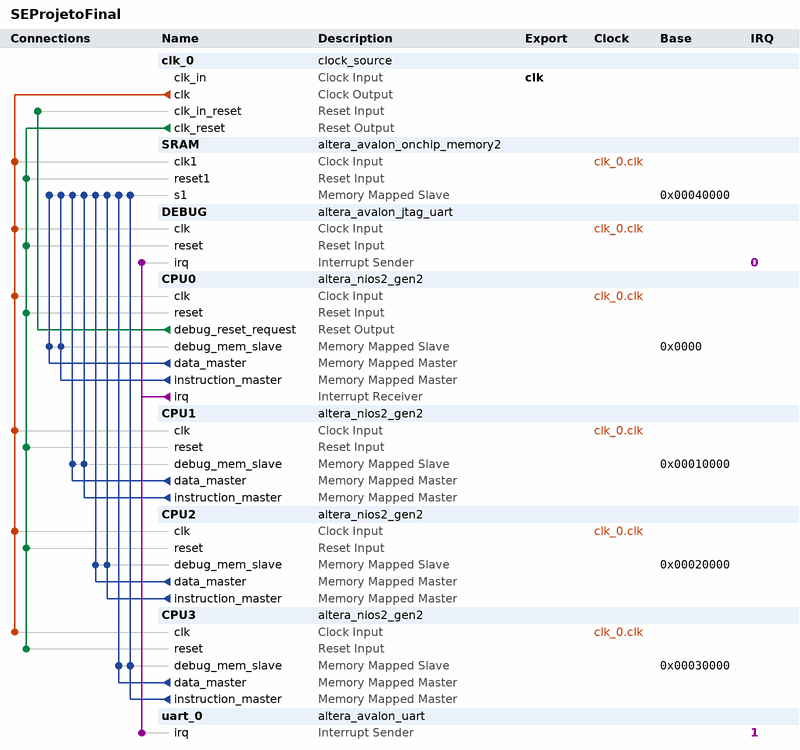
[diagram p0: system contents]
# Platform Designer (Qsys) system SEProjetoFinal, Cyclone IV E EP4CE115F29C7
# Parameters at their usual value, and those the tool derives, are not listed.
package require -exact qsys 21.1
create_system SEProjetoFinal
set_project_property DEVICE_FAMILY {Cyclone IV E}
set_project_property DEVICE EP4CE115F29C7

add_instance clk_0 clock_source 21.1
set_instance_parameter_value clk_0 clockFrequency 50000000

add_instance SRAM altera_avalon_onchip_memory2 21.1
set_instance_parameter_value SRAM dataWidth 32
set_instance_parameter_value SRAM dualPort false
set_instance_parameter_value SRAM initMemContent true
set_instance_parameter_value SRAM initializationFileName onchip_mem.hex
set_instance_parameter_value SRAM memorySize 262144

add_instance DEBUG altera_avalon_jtag_uart 21.1
set_instance_parameter_value DEBUG simInteractiveOptions NO_INTERACTIVE_WINDOWS

add_instance CPU0 altera_nios2_gen2 21.1
set_instance_parameter_value CPU0 dcache_size 2048
set_instance_parameter_value CPU0 exceptionSlave SRAM.s1
set_instance_parameter_value CPU0 icache_size 4096
set_instance_parameter_value CPU0 impl Fast
set_instance_parameter_value CPU0 resetSlave SRAM.s1

add_instance CPU1 altera_nios2_gen2 21.1
set_instance_parameter_value CPU1 dcache_size 2048
set_instance_parameter_value CPU1 exceptionSlave SRAM.s1
set_instance_parameter_value CPU1 icache_size 4096
set_instance_parameter_value CPU1 impl Fast
set_instance_parameter_value CPU1 resetSlave SRAM.s1

add_instance CPU2 altera_nios2_gen2 21.1
set_instance_parameter_value CPU2 dcache_size 2048
set_instance_parameter_value CPU2 exceptionSlave SRAM.s1
set_instance_parameter_value CPU2 icache_size 4096
set_instance_parameter_value CPU2 impl Fast
set_instance_parameter_value CPU2 resetSlave SRAM.s1

add_instance CPU3 altera_nios2_gen2 21.1
set_instance_parameter_value CPU3 dcache_size 2048
set_instance_parameter_value CPU3 exceptionSlave SRAM.s1
set_instance_parameter_value CPU3 icache_size 4096
set_instance_parameter_value CPU3 impl Fast
set_instance_parameter_value CPU3 resetSlave SRAM.s1

add_instance uart_0 altera_avalon_uart 21.1
set_instance_parameter_value uart_0 baud 115200
set_instance_parameter_value uart_0 dataBits 8
set_instance_parameter_value uart_0 fixedBaud true
set_instance_parameter_value uart_0 parity NONE
set_instance_parameter_value uart_0 stopBits 1

# connections
add_connection clk_0.clk CPU0.clk clock
add_connection clk_0.clk CPU1.clk clock
add_connection clk_0.clk CPU2.clk clock
add_connection clk_0.clk CPU3.clk clock
add_connection clk_0.clk DEBUG.clk clock
add_connection clk_0.clk SRAM.clk1 clock
add_connection clk_0.clk_reset CPU0.reset reset
add_connection clk_0.clk_reset CPU1.reset reset
add_connection clk_0.clk_reset CPU2.reset reset
add_connection clk_0.clk_reset CPU3.reset reset
add_connection clk_0.clk_reset DEBUG.reset reset
add_connection clk_0.clk_reset SRAM.reset1 reset
add_connection CPU0.debug_reset_request clk_0.clk_in_reset reset
add_connection CPU0.data_master CPU0.debug_mem_slave avalon
set_connection_parameter_value CPU0.data_master/CPU0.debug_mem_slave baseAddress 0x0000
add_connection CPU0.data_master SRAM.s1 avalon
set_connection_parameter_value CPU0.data_master/SRAM.s1 baseAddress 0x00040000
add_connection CPU0.instruction_master CPU0.debug_mem_slave avalon
set_connection_parameter_value CPU0.instruction_master/CPU0.debug_mem_slave baseAddress 0x0000
add_connection CPU0.instruction_master SRAM.s1 avalon
set_connection_parameter_value CPU0.instruction_master/SRAM.s1 baseAddress 0x00040000
add_connection CPU1.data_master CPU1.debug_mem_slave avalon
set_connection_parameter_value CPU1.data_master/CPU1.debug_mem_slave baseAddress 0x00010000
add_connection CPU1.data_master SRAM.s1 avalon
set_connection_parameter_value CPU1.data_master/SRAM.s1 baseAddress 0x00040000
add_connection CPU1.instruction_master CPU1.debug_mem_slave avalon
set_connection_parameter_value CPU1.instruction_master/CPU1.debug_mem_slave baseAddress 0x00010000
add_connection CPU1.instruction_master SRAM.s1 avalon
set_connection_parameter_value CPU1.instruction_master/SRAM.s1 baseAddress 0x00040000
add_connection CPU2.data_master CPU2.debug_mem_slave avalon
set_connection_parameter_value CPU2.data_master/CPU2.debug_mem_slave baseAddress 0x00020000
add_connection CPU2.data_master SRAM.s1 avalon
set_connection_parameter_value CPU2.data_master/SRAM.s1 baseAddress 0x00040000
add_connection CPU2.instruction_master CPU2.debug_mem_slave avalon
set_connection_parameter_value CPU2.instruction_master/CPU2.debug_mem_slave baseAddress 0x00020000
add_connection CPU2.instruction_master SRAM.s1 avalon
set_connection_parameter_value CPU2.instruction_master/SRAM.s1 baseAddress 0x00040000
add_connection CPU3.data_master CPU3.debug_mem_slave avalon
set_connection_parameter_value CPU3.data_master/CPU3.debug_mem_slave baseAddress 0x00030000
add_connection CPU3.data_master SRAM.s1 avalon
set_connection_parameter_value CPU3.data_master/SRAM.s1 baseAddress 0x00040000
add_connection CPU3.instruction_master CPU3.debug_mem_slave avalon
set_connection_parameter_value CPU3.instruction_master/CPU3.debug_mem_slave baseAddress 0x00030000
add_connection CPU3.instruction_master SRAM.s1 avalon
set_connection_parameter_value CPU3.instruction_master/SRAM.s1 baseAddress 0x00040000
add_connection CPU0.irq DEBUG.irq interrupt
set_connection_parameter_value CPU0.irq/DEBUG.irq irqNumber 0
add_connection CPU0.irq uart_0.irq interrupt
set_connection_parameter_value CPU0.irq/uart_0.irq irqNumber 1

# exported interfaces
add_interface clk clock sink
set_interface_property clk EXPORT_OF clk_0.clk_in

set_interconnect_requirement {$system} qsys_mm.clockCrossingAdapter HANDSHAKE
set_interconnect_requirement {$system} qsys_mm.enableEccProtection FALSE
set_interconnect_requirement {$system} qsys_mm.insertDefaultSlave FALSE
set_interconnect_requirement {$system} qsys_mm.maxAdditionalLatency 1

save_system SEProjetoFinal.qsys
